# EAGLE design shinobi_5v_3V3_dcdc_jack (EAGLE 8.2.2)
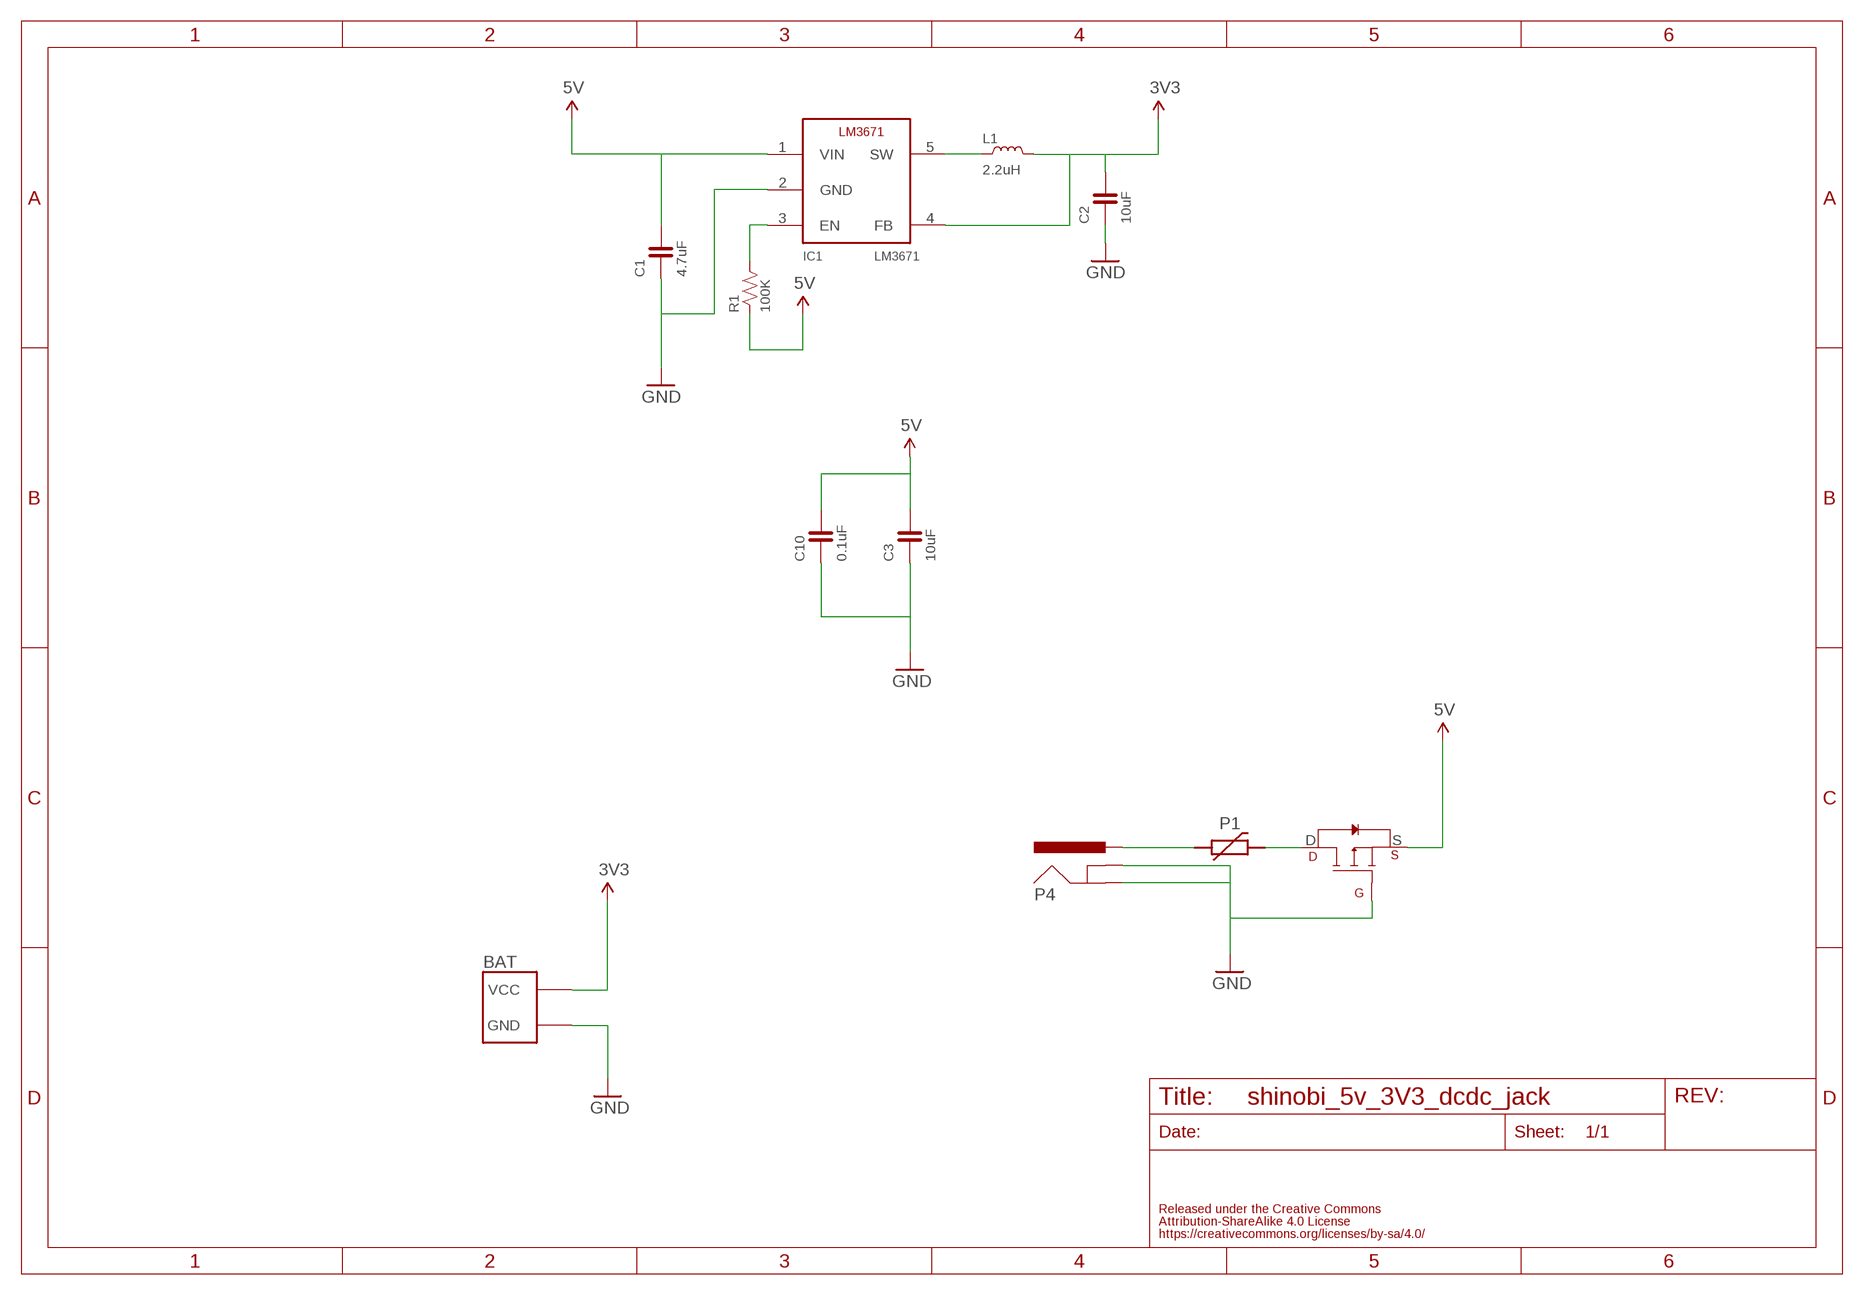
[diagram p0: schematic, sheet 1]

## Parts
BAT  FABO_BRICK_2PIN_SIDE  [FABO_BRICK_2PIN_S02B−PASK-2_SILK]
C1  4.7uF  CAPACITOR-0603  [0603]
C2  10uF  CAPACITOR-0603  [0603]
C3  10uF  CAPACITOR-0603  [0603]
C10  0.1uF  CAPACITOR-0603  [0603]
IC1  LM3671  [LM3671]
L1  2.2uH  INDUCTOR2.4X2.4  [2.4X2.4]
M1  AOD417  [AOD417]
P1  POLYSWITCH1210  [1210]
P4  DC-JACK2DC-G232-B66  [2DC-G213-B66]
R1  100K  RESISTOR-0603  [0603]

## Nets
3V3: BAT.VCC C2.2 IC1.4(FB) L1.P$2
5V: C1.2 C3.2 C10.2 IC1.1(VIN) M1.S R1.1
GND: BAT.GND C1.1 C2.1 C3.1 C10.1 IC1.2(GND) M1.G P4.GND P4.GND-BREAKE@2(GNDBREAK) P4.GND-BREAKER@1(GNDBREAK) P4.GND-BREAKER@3(GNDBREAK) P4.GND-BREAKER@4(GNDBREAK)
N$1: IC1.3(EN) R1.2
N$2: IC1.5(SW) L1.P$1
N$3: P1.P$1 P4.VCC(PWR)
N$15: M1.D P1.P$2

## Library data of the parts
BAT = FaBo-Template:FABO_BRICK_2PIN
C1-C3 C10 = FaBo-Capacitor:CAPACITOR: CAPACITOR
IC1 = FaBo-Supply:LM3671
L1 = FaBo-Coil:INDUCTOR
M1 = FaBo-Transistor:AOD417
P1 = FaBo-Supply:POLYSWITCH
P4 = FaBo-Supply:DC-JACK
R1 = FaBo-Resistors:RESISTOR: RESISTOR

## Board
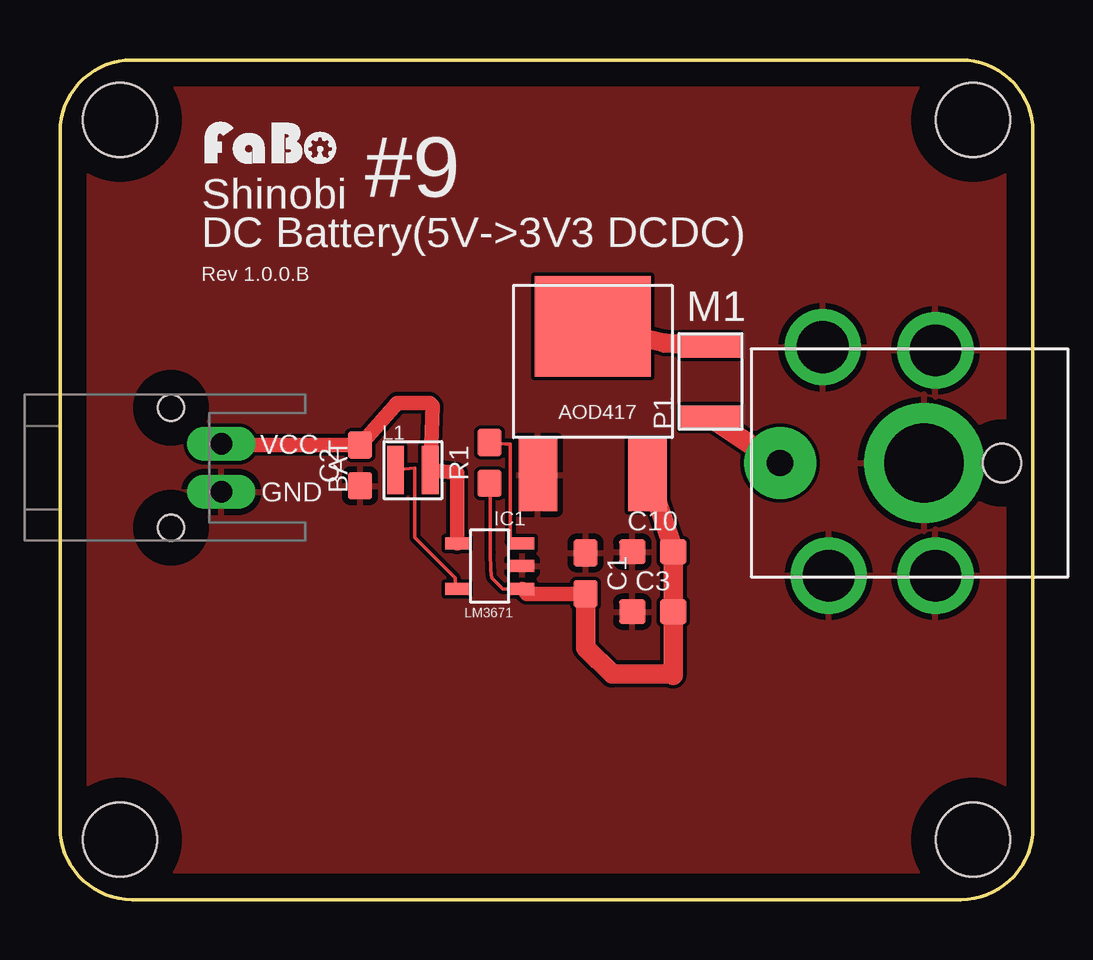
[diagram p1: board, top side]
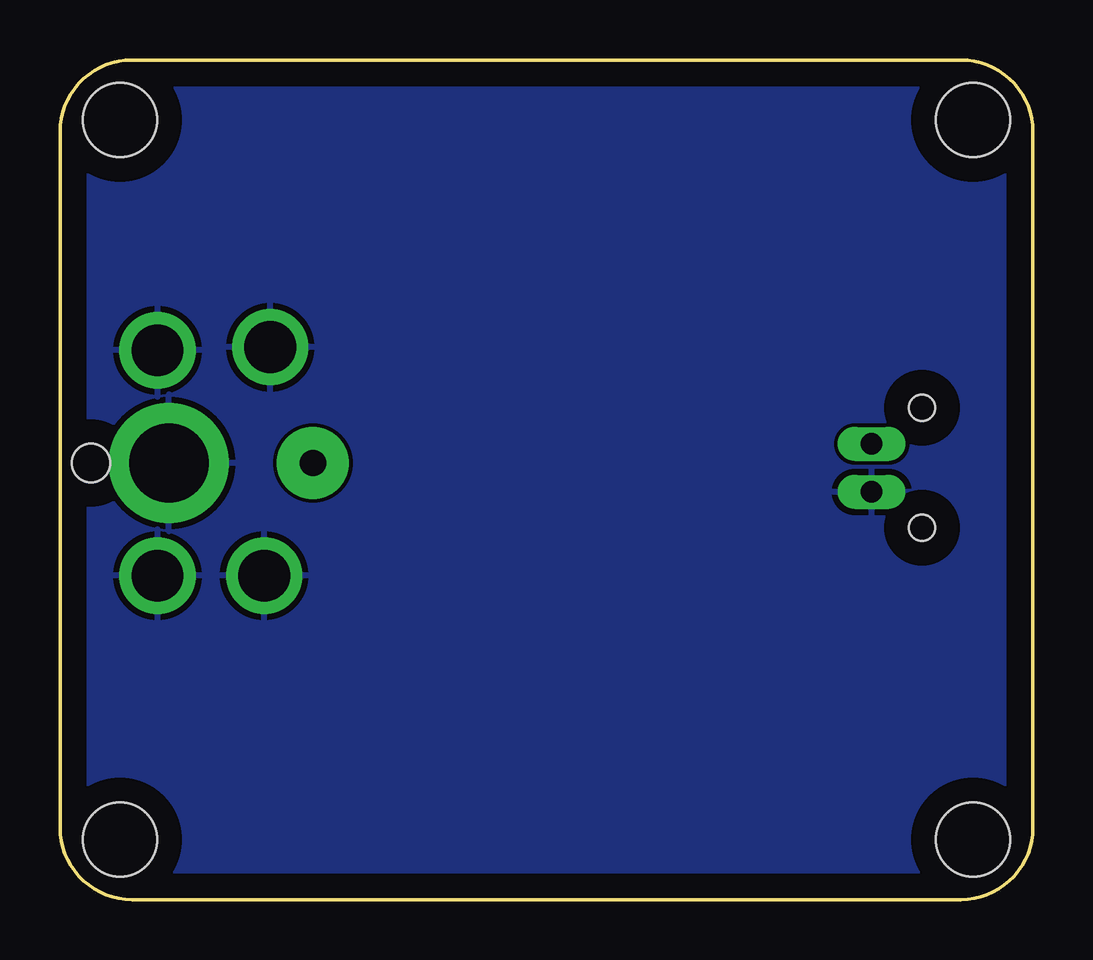
[diagram p2: board, bottom side, seen from below]

Size 40.54 x 35 mm. Coordinates in mm from the lower left corner, seen from the top.
Copper layers (1*16): Top 0.035mm / dielectric 1.5mm / Bottom 0.035mm
Design rules "default": minimum track width 6mil, minimum drill 0.35mm, track to track 6mil, track to pad 6mil, pad to pad 6mil, via to via 6mil, smd to smd 6mil, copper to edge 40mil, drill to drill 6mil, minimum pad ring 10mil, minimum via ring 8mil, stop-mask expansion 4mil, vias tented up to drill 0mil, thermal gap 10mil

### Footprints (pad centres in the part's own frame; a part is rotated, then mirrored left to right if it is on the bottom)
FABO_BRICK_2PIN_S02B−PASK-2_SILK = drill 0.9 pad 1.422 long: GND -1,-0.102; VCC 1,-0.102 | hole 1.1: 2.5,1.998; -2.5,1.998
0603 = smd 1.1 x 1: 1 -0.85,0; 2 0.85,0
LM3671 = smd 1 x 0.5: 1 -1.35,0.95; 2 -1.35,0; 3 -1.35,-0.95; 4 1.35,-0.95; 5 1.35,0.95
2.4X2.4 = smd 0.7 x 2: P$1 -0.725,0; P$2 0.725,0
AOD417 = smd 4.82 x 4.2: D 0,2.1 | smd 1.6 x 3: G -2.286,-4.1; S 2.286,-4.1
1210 = smd 1 x 2.5: P$1 -1.5,0; P$2 1.5,0
2DC-G213-B66 = drill 3.3 pad 5: GND 0,0 | drill 2.159 pad 3: GND-BREAKE@2 -4.699,0.477; GND-BREAKER@1 -4.826,-4.222; GND-BREAKER@3 4.699,-3.968; GND-BREAKER@4 4.699,0.477 | drill 1.1 pad 3: VCC 0,-6 | hole 1.6: 0,3.25
FABO-SHINOBI = hole 3.1: 2.5,32.5; 38.04,32.5; 38.04,2.5; 2.5,2.5

### Placement (x,y rotation side)
BAT  6.62,18 90 top
C1  21.9,13.6 270 top
C2  12.5,18.1 90 top
C3  24.7,12 0 top
C10  24.7,14.5 0 top
IC1  17.9,13.9 180 top
L1  14.7,17.9 0 top
M1  22.2,21.8 0 top
P1  27.1,21.6 90 top
P4  36,18.2 270 top
R1  17.9,18.2 90 top
U$2  [LOGO_FABO_S]  8.83,30.52 0 top
U$3  [FABO-SHINOBI]  0,0 0 top

### Tracks (layer width: path | path; a pad name or v marks a point on that pad's centre or on a via)
3V3
  Top 0.61: IC1.4 16.55,17.77 L1.P$2 15.53,20.57 15.4,20.7 14.05,20.7 C2.2 6.77,18.95 BAT.VCC
5V
  Top 0.152: R1.1 17.94,16.8 17.94,14.48 17.95,13.73 17.98,13.41 18.44,12.95 19.05,12.95 IC1.1
  Top 0.61: C1.2 19.45,12.75 IC1.1
  Top 0.813: M1.S 25.59,14.54 C10.2 C3.2 25.55,9.35 25.4,9.4 23,9.4 21.9,10.5 C1.2
GND
  pour Bottom: 0,0 41,0 41,35 0,35
  pour Top: 0,0 41,0 41,35 0,35
N$1
  Top 0.152: IC1.3 18.75,14.93 18.75,17.03 18.76,19 18.56,19 R1.2
N$2
  Top 0.152: IC1.5 16.46,12.95 16.46,13.41 14.78,15.09 14.78,17.98 L1.P$1
N$3
  Top 0.813: P4.VCC 29.9,18.2 P1.P$1
N$15
  Top 0.152: 23.57,24.26 23.63,24.2 M1.D
  Top 0.813: 23.1,24.1 23.57,24.26 23.7,23.6 | P1.P$2 25.2,23.2 M1.D

### Text on the board
tPlace: Shinobi | #9 | DC Battery(5V->3V3 DCDC) | Rev 1.0.0.B